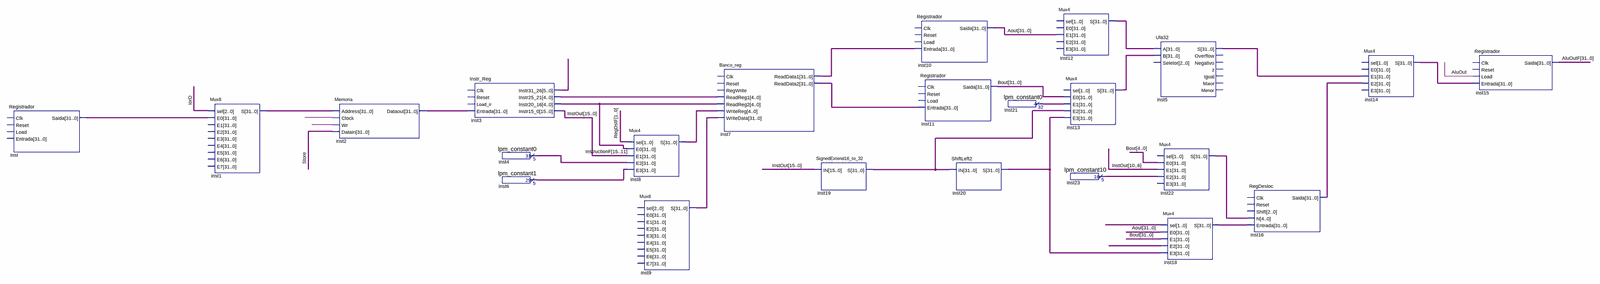
[diagram p0: schematic sheet, whole]
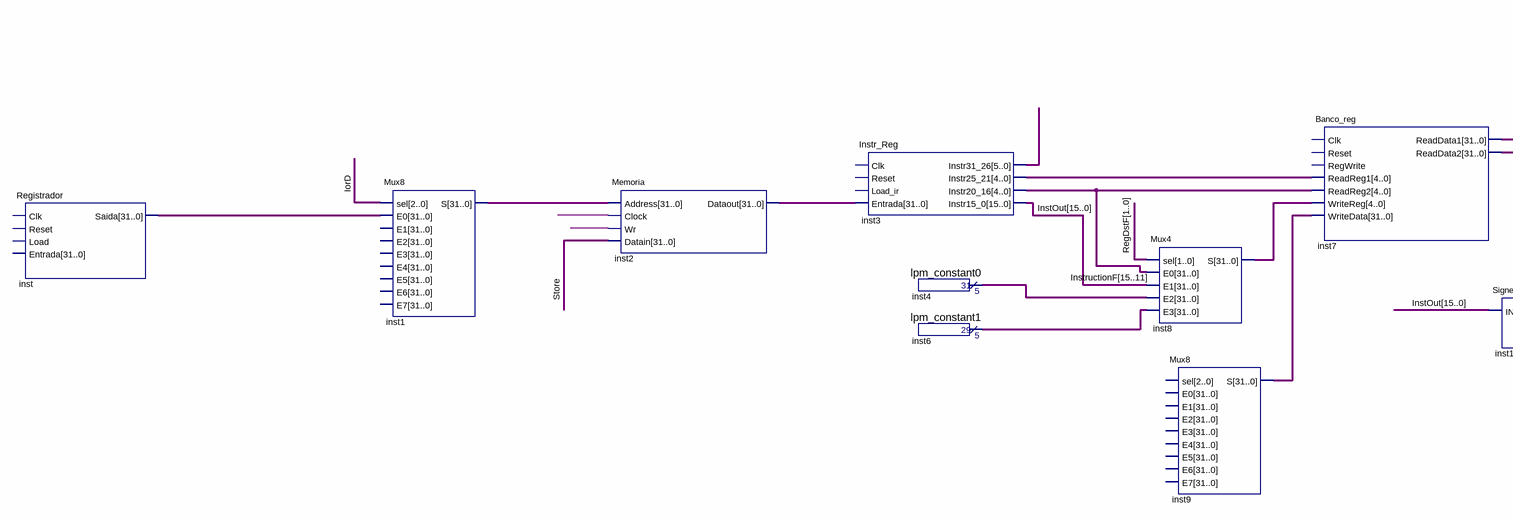
[diagram p1: schematic sheet, left part]
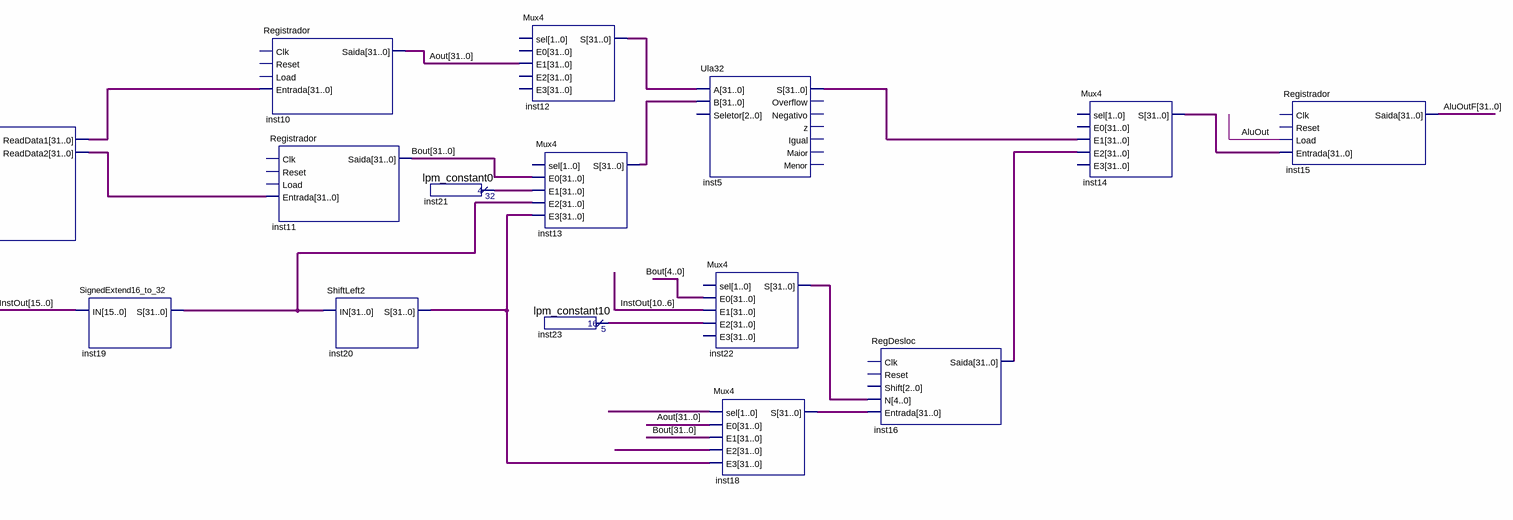
[diagram p2: schematic sheet, right part]
// Quartus schematic ProjetoHardWare.bdf as structural Verilog: 23 symbols, 0 pins
module ProjetoHardWare (
);

  wire AluOut, IorD, Store, undriven, undriven_2;
  wire [1:0] RegDstF, undriven_4;
  wire [4:0] inst3_instr25_21;
  wire [5:0] inst3_instr31_26;
  wire [15:0] InstOut;
  wire [15:11] InstructionF;
  wire [31:0] AluOutF, Aout, Bout, inst1_s, inst2_dataout, inst3_instr20_16, inst4_result, inst5_s,
       inst6_result, inst7_readdata1, inst7_readdata2, inst8_s, inst9_s, inst12_s, inst13_s, inst14_s,
       inst16_saida, inst18_s, inst19_s, inst20_s, inst21_result, inst22_s, inst23_result, inst_saida,
       undriven_3;

  Registrador inst (.Saida(inst_saida));  // open: Clk, Reset, Load, Entrada
  Mux8 inst1 (.sel({3{IorD}}), .E0(inst_saida), .S(inst1_s));  // open: E1, E2, E3, E4, E5, E6, E7
  Memoria inst2 (.Address(inst1_s), .Clock(undriven_2), .Wr(undriven), .Datain({32{Store}}), .Dataout(inst2_dataout));
  Instr_Reg inst3 (
    .Entrada(inst2_dataout), .Instr31_26(inst3_instr31_26), .Instr25_21(inst3_instr25_21),
    .Instr20_16(inst3_instr20_16), .Instr15_0(InstOut));  // open: Clk, Reset, Load_ir
  lpm_constant0 inst4 (.result(inst4_result));
  lpm_constant1 inst6 (.result(inst6_result));
  Mux4 inst8 (
    .sel(RegDstF), .E0(inst3_instr20_16), .E1(InstructionF), .E2(inst4_result), .E3(inst6_result), .S(inst8_s));
  Mux8 inst9 (.S(inst9_s));  // open: sel, E0, E1, E2, E3, E4, E5, E6, E7
  Banco_reg inst7 (
    .ReadReg1(inst3_instr25_21), .ReadReg2(inst3_instr20_16), .WriteReg(inst8_s), .WriteData(inst9_s),
    .ReadData1(inst7_readdata1), .ReadData2(inst7_readdata2));  // open: Clk, Reset, RegWrite
  SignedExtend16_to_32 inst19 (.IN(InstOut), .S(inst19_s));
  Registrador inst10 (.Entrada(inst7_readdata1), .Saida(Aout));  // open: Clk, Reset, Load
  Registrador inst11 (.Entrada(inst7_readdata2), .Saida(Bout));  // open: Clk, Reset, Load
  ShiftLeft2 inst20 (.IN(inst19_s), .S(inst20_s));
  lpm_constant0 inst21 (.result(inst21_result));
  Mux4 inst12 (.E1(Aout), .S(inst12_s));  // open: sel, E0, E2, E3
  Mux4 inst13 (.E0(Bout), .E1(inst21_result), .E2(inst19_s), .E3(inst20_s), .S(inst13_s));  // open: sel
  lpm_constant10 inst23 (.result(inst23_result));
  Ula32 inst5 (.A(inst12_s), .B(inst13_s), .S(inst5_s));  // open: Seletor, Overflow, Negativo, z, Igual, Maior, Menor
  Mux4 inst22 (.E0(Bout[4:0]), .E1(InstOut[10:6]), .E2(inst23_result), .S(inst22_s));  // open: sel, E3
  Mux4 inst18 (.sel(undriven_4), .E0(Aout), .E1(Bout), .E2(undriven_3), .E3(inst20_s), .S(inst18_s));
  RegDesloc inst16 (.N(inst22_s), .Entrada(inst18_s), .Saida(inst16_saida));  // open: Clk, Reset, Shift
  Mux4 inst14 (.E1(inst5_s), .E2(inst16_saida), .S(inst14_s));  // open: sel, E0, E3
  Registrador inst15 (.Load(AluOut), .Entrada(inst14_s), .Saida(AluOutF));  // open: Clk, Reset
endmodule
